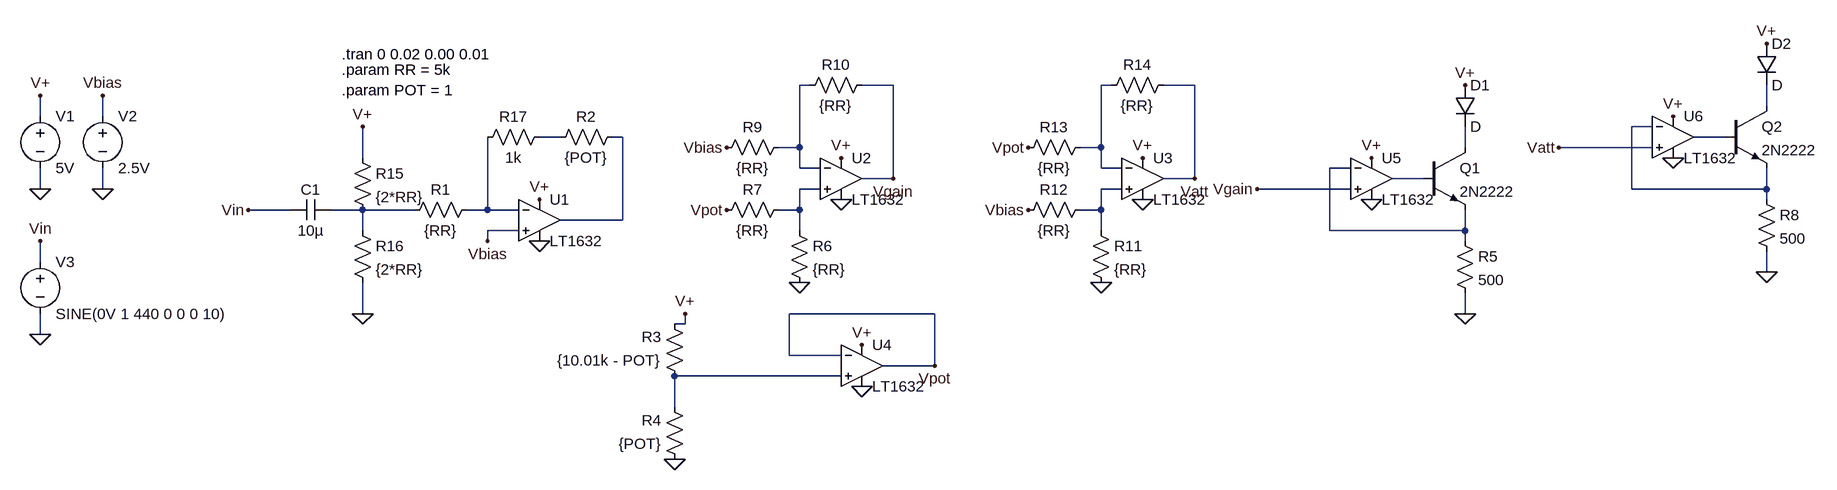
[diagram p0: schematic FrontEnd.asc]
FrontEnd.asc, the LTspice schematic file:
Version 4
SHEET 1 2168 680
WIRE 608 -80 592 -80
WIRE 736 -80 688 -80
WIRE 1072 -80 1056 -80
WIRE 1200 -80 1152 -80
WIRE 2080 -48 2080 -80
WIRE -576 -32 -576 -64
WIRE -480 -32 -480 -64
WIRE 1904 -16 1872 -16
WIRE 224 0 192 0
WIRE 320 0 304 0
WIRE 2016 0 1968 0
WIRE 592 16 592 -80
WIRE 592 16 560 16
WIRE 1056 16 1056 -80
WIRE 1056 16 1024 16
WIRE 1616 16 1616 -16
WIRE 1904 16 1760 16
WIRE -80 32 -80 -16
WIRE 592 48 592 16
WIRE 624 48 592 48
WIRE 1056 48 1056 16
WIRE 1088 48 1056 48
WIRE 1440 48 1408 48
WIRE 736 64 736 -80
WIRE 736 64 688 64
WIRE 1200 64 1200 -80
WIRE 1200 64 1152 64
WIRE 1552 64 1504 64
WIRE -576 80 -576 48
WIRE -480 80 -480 48
WIRE 624 80 592 80
WIRE 1088 80 1056 80
WIRE 1440 80 1296 80
WIRE 1872 80 1872 -16
WIRE 2080 80 2080 48
WIRE 2080 80 1872 80
WIRE 2080 96 2080 80
WIRE -192 112 -256 112
WIRE -80 112 -128 112
WIRE 0 112 -80 112
WIRE 112 112 112 0
WIRE 112 112 80 112
WIRE 160 112 112 112
WIRE 592 112 592 80
WIRE 592 112 560 112
WIRE 1056 112 1056 80
WIRE 1056 112 1024 112
WIRE 320 128 320 0
WIRE 320 128 224 128
WIRE -80 144 -80 112
WIRE 160 144 112 144
WIRE 592 144 592 112
WIRE 1056 144 1056 112
WIRE 1408 144 1408 48
WIRE 1616 144 1616 112
WIRE 1616 144 1408 144
WIRE 112 160 112 144
WIRE 1616 160 1616 144
WIRE -576 192 -576 160
WIRE 2080 208 2080 176
WIRE -80 272 -80 224
WIRE 800 272 576 272
WIRE 1616 272 1616 240
WIRE 416 288 416 272
WIRE 416 288 400 288
WIRE -576 304 -576 272
WIRE 576 336 576 272
WIRE 656 336 576 336
WIRE 800 352 800 272
WIRE 800 352 720 352
WIRE 656 368 400 368
WIRE 400 416 400 368
FLAG -576 80 0
FLAG -576 304 0
FLAG -480 80 0
FLAG -576 -64 V+
FLAG -480 -64 Vbias
FLAG -576 160 Vin
FLAG 192 160 0
FLAG 192 96 V+
FLAG 112 160 Vbias
FLAG 1616 -80 V+
FLAG 1616 272 0
FLAG 2080 -144 V+
FLAG 2080 208 0
FLAG 656 96 0
FLAG 656 32 V+
FLAG 592 224 0
FLAG 480 112 Vpot
FLAG 480 16 Vbias
FLAG 1120 96 0
FLAG 1120 32 V+
FLAG 1056 224 0
FLAG 944 112 Vbias
FLAG 944 16 Vpot
FLAG 736 64 Vgain
FLAG 1200 64 Vatt
FLAG -80 272 0
FLAG -80 -16 V+
FLAG -256 112 Vin
FLAG 688 384 0
FLAG 688 320 V+
FLAG 800 352 Vpot
FLAG 1472 96 0
FLAG 1472 32 V+
FLAG 1296 80 Vgain
FLAG 1936 32 0
FLAG 1936 -32 V+
FLAG 1760 16 Vatt
FLAG 400 496 0
FLAG 416 272 V+
SYMBOL voltage -576 -48 R0
WINDOW 123 0 0 Left 0
WINDOW 39 0 0 Left 0
SYMATTR InstName V1
SYMATTR Value 5V
SYMBOL voltage -576 176 R0
WINDOW 123 0 0 Left 0
WINDOW 39 0 0 Left 0
SYMATTR InstName V3
SYMATTR Value SINE(0V 1 440 0 0 0 10)
SYMBOL voltage -480 -48 R0
WINDOW 123 0 0 Left 0
WINDOW 39 0 0 Left 0
SYMATTR InstName V2
SYMATTR Value 2.5V
SYMBOL Opamps\\LT1632 192 64 R0
SYMATTR InstName U1
SYMBOL res 96 96 R90
WINDOW 0 0 56 VBottom 2
WINDOW 3 32 56 VTop 2
SYMATTR InstName R1
SYMATTR Value {RR}
SYMBOL res 320 -16 R90
WINDOW 0 0 56 VBottom 2
WINDOW 3 32 56 VTop 2
SYMATTR InstName R2
SYMATTR Value {POT}
SYMBOL npn 1552 16 R0
SYMATTR InstName Q1
SYMATTR Value 2N2222
SYMBOL diode 1600 -80 R0
SYMATTR InstName D1
SYMBOL res 1600 144 R0
SYMATTR InstName R5
SYMATTR Value 500
SYMBOL npn 2016 -48 R0
SYMATTR InstName Q2
SYMATTR Value 2N2222
SYMBOL diode 2064 -144 R0
SYMATTR InstName D2
SYMBOL res 2064 80 R0
SYMATTR InstName R8
SYMATTR Value 500
SYMBOL Opamps\\LT1632 656 0 R0
SYMATTR InstName U2
SYMBOL res 576 128 R0
SYMATTR InstName R6
SYMATTR Value {RR}
SYMBOL res 576 96 R90
WINDOW 0 0 56 VBottom 2
WINDOW 3 32 56 VTop 2
SYMATTR InstName R7
SYMATTR Value {RR}
SYMBOL res 576 0 R90
WINDOW 0 0 56 VBottom 2
WINDOW 3 32 56 VTop 2
SYMATTR InstName R9
SYMATTR Value {RR}
SYMBOL res 704 -96 R90
WINDOW 0 0 56 VBottom 2
WINDOW 3 32 56 VTop 2
SYMATTR InstName R10
SYMATTR Value {RR}
SYMBOL Opamps\\LT1632 1120 0 R0
SYMATTR InstName U3
SYMBOL res 1040 128 R0
SYMATTR InstName R11
SYMATTR Value {RR}
SYMBOL res 1040 96 R90
WINDOW 0 0 56 VBottom 2
WINDOW 3 32 56 VTop 2
SYMATTR InstName R12
SYMATTR Value {RR}
SYMBOL res 1040 0 R90
WINDOW 0 0 56 VBottom 2
WINDOW 3 32 56 VTop 2
SYMATTR InstName R13
SYMATTR Value {RR}
SYMBOL res 1168 -96 R90
WINDOW 0 0 56 VBottom 2
WINDOW 3 32 56 VTop 2
SYMATTR InstName R14
SYMATTR Value {RR}
SYMBOL res -96 16 R0
SYMATTR InstName R15
SYMATTR Value {2*RR}
SYMBOL res -96 128 R0
SYMATTR InstName R16
SYMATTR Value {2*RR}
SYMBOL cap -128 96 R90
WINDOW 0 0 32 VBottom 2
WINDOW 3 32 32 VTop 2
SYMATTR InstName C1
SYMATTR Value 10µ
SYMBOL Opamps\\LT1632 688 288 R0
SYMATTR InstName U4
SYMBOL Opamps\\LT1632 1472 0 R0
SYMATTR InstName U5
SYMBOL Opamps\\LT1632 1936 -64 R0
SYMATTR InstName U6
SYMBOL res 208 -16 R90
WINDOW 0 0 56 VBottom 2
WINDOW 3 32 56 VTop 2
SYMATTR InstName R17
SYMATTR Value 1k
SYMBOL res 416 384 R180
WINDOW 0 36 76 Left 2
WINDOW 3 36 40 Left 2
SYMATTR InstName R3
SYMATTR Value {10.01k - POT}
SYMBOL res 416 512 R180
WINDOW 0 36 76 Left 2
WINDOW 3 36 40 Left 2
SYMATTR InstName R4
SYMATTR Value {POT}
TEXT -112 -128 Left 2 !.tran 0 0.02 0.00 0.01
TEXT -112 -72 Left 2 !.param POT = 1
TEXT -112 -104 Left 2 !.param RR = 5k

The netlist it stands for:
* FrontEnd.asc
V1 V+ 0 5V
V3 Vin 0 SINE(0V 1 440 0 0 0 10)
V2 Vbias 0 2.5V
XU1 Vbias N014 V+ 0 N006 LT1632  ; pins In+ In- V+ V- OUT
R1 N014 N013 {RR}
R2 N006 N005 {POT}
Q1 N008 N010 N009 0 2N2222
D1 V+ N008 D
R5 N009 0 500
Q2 N003 N007 N004 0 2N2222
D2 V+ N003 D
R8 N004 0 500
XU2 N011 N001 V+ 0 Vgain LT1632  ; pins In+ In- V+ V- OUT
R6 N011 0 {RR}
R7 N011 Vpot {RR}
R9 N001 Vbias {RR}
R10 Vgain N001 {RR}
XU3 N012 N002 V+ 0 Vatt LT1632  ; pins In+ In- V+ V- OUT
R11 N012 0 {RR}
R12 N012 Vbias {RR}
R13 N002 Vpot {RR}
R14 Vatt N002 {RR}
R15 V+ N013 {2*RR}
R16 N013 0 {2*RR}
C1 N013 Vin 10µ
XU4 N015 Vpot V+ 0 Vpot LT1632  ; pins In+ In- V+ V- OUT
XU5 Vgain N009 V+ 0 N010 LT1632  ; pins In+ In- V+ V- OUT
XU6 Vatt N004 V+ 0 N007 LT1632  ; pins In+ In- V+ V- OUT
R17 N005 N014 1k
R3 N015 V+ {10.01k - POT}
R4 0 N015 {POT}
.model D D
.lib standard.dio
.model NPN NPN
.model PNP PNP
.lib standard.bjt
.tran 0 0.02 0.00 0.01
.param POT = 1
.param RR = 5k
.lib LTC.lib
.backanno
.end